# Altium schematic sheet PWR_LMR33630_5v_3A.SchDoc
size A3; SheetNumber: 22; SheetTotal: 22
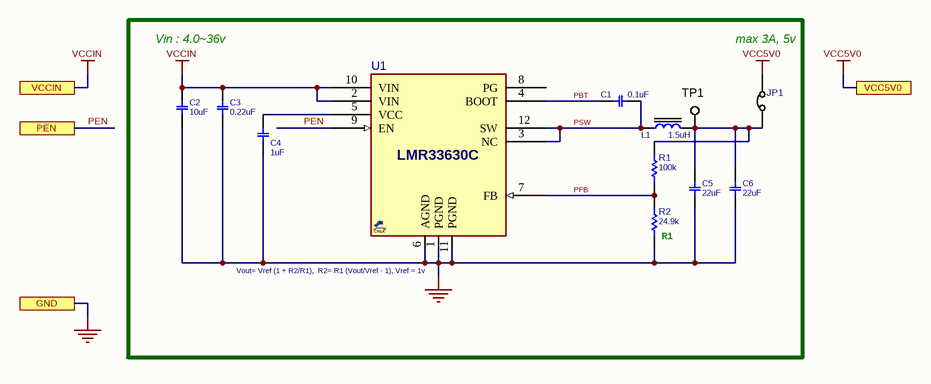
[diagram p0: PWR_LMR33630_5v_3A.SchDoc]

## Parts
C1  0.1uF  [C0402]
C2  10uF  [C0402]
C3  0.22uF  [C0402]
C4  1uF  [C0402]
C5  22uF  [C0402]
C6  22uF  [C0402]
JP1  R0Ohm  [JP_100X60]  (value not drawn)
L1  1.5uH  [L1210]
R1  100k  [R0402]
R2  24.9k  [R0402]
TP1  TESTPOINT_SMD  [TPSMD_S1]  (value not drawn)  (no BOM)
U1  LMR33630C  [QFNHR_12_RNX]  (value not drawn)

## Ports
GND, PEN, VCC5V0, VCCIN

## Nets
GND: C2.1 C3.2 C4.1 C5.1 C6.1 R2.2 U1.1(PGND) U1.6(AGND) U1.11(PGND) ; port GND
VCC5V0: JP1.2 ; port VCC5V0
VCCIN: C2.2 C3.1 U1.2(VIN) U1.10(VIN) ; port VCCIN
PBT: C1.1 U1.4(BOOT)
PEN: U1.9(EN) ; port PEN
PFB: R1.2 R2.1 U1.7(FB)
PSW: C1.2 L1.1 U1.3(NC) U1.12(SW)
NetC4_2: C4.2 U1.5(VCC)
NetC5_2: C5.2 C6.2 JP1.1 L1.2 R1.1 TP1.1

Not connected (* = marked no-connect by the designer): U1 8(PG)

## Notes on the sheet
- Vin : 4.0~36v
- (near JP1) max 3A, 5v
- (near R2) R1
- (near U1) Vout= Vref (1 + R2/R1),  R2= R1 (Vout/Vref - 1), Vref = 1v

## Library data of the parts
C1 = CAP_SMD_MLCC_100n50V: CAP, MLCC, 100nF, 50V, X7R, 10%, 0402C; PARAM: X5R, 10%; MANF: Murata; PARAM2: 25v; MANF_P#: GRM155R61E104; DESC: CAP, MLCC, 100nF, 50V, X7R, 10%, 0402C; ASSEMBLY: ASSEMBLY; PRICE: 10,000:$0.006; VALUE: 0.1uF; PACKAGE: 0402
C2 = CAP_SMD_MLCC: CAP, MLCC; PARAM: X5R, 20%; MANF_P#: CL05A106MP5NUNC; MANF: Samsung; PARAM2: 10v; PRICE: 10,000: $0.034; ASSEMBLY: ASSEMBLY; VALUE: 10uF; PACKAGE: 0402
C3 = CAP_SMD_MLCC_100n50V: CAP, MLCC, 0402C; PARAM: 50V; MANF: -; DESC: -; PARAM2: -; ASSEMBLY: ASSEMBLY; PRICE: 100= 1.3$; VALUE: 0.22uF; MANF_P#: -; PACKAGE: 0402
C4 = CAP_SMD_MLCC: CAP, MLCC; PARAM: X5R, 10%; MANF_P#: CL05A105KO5NNND; MANF: Samsung; PARAM2: 16v; PRICE: 50,000:	$0.006; ASSEMBLY: ASSEMBLY; VALUE: 1uF; PACKAGE: 0402
C5 C6 = CAP_SMD_MLCC: CAP, MLCC; PARAM: X5R, 10%; MANF_P#: GRM158R61A226ME15; MANF: Murata; PARAM2: 10v; PRICE: 8,000: $0.124; ASSEMBLY: ASSEMBLY; VALUE: 22uF; PACKAGE: 0603
JP1 = JUMPER_HDR_2P: JUMPER, HEADER 2PIN; MANF: -; MANF_P#: -; VALUE: R0Ohm
L1 = IND_SMD_2.2uH_4A: INDUCTOR; PARAM: 4.4A Irms, 5.0A Isat; MANF: Bourns; PARAM2: 22mOhm; MANF_P#: SRP3212A-1R5M; PRICE: 1.3$; DESC: -; ASSEMBLY: ASSEMBLY; VALUE: 1.5uH
R1 R2 = RES_SMD: RESISTOR, SMD, 20K, 0402; PARAM: 0.063W; DIST#: MOUSER; PARAM2: 1%; MANF: -; ASSEMBLY: ASSEMBLY; PRICE: 100= 0.5$; DESC: RESISTOR, SMD, 20K, 0402; MANF_P#: -; PACKAGE: 0402
  R1: VALUE: 100k
  R2: VALUE: 24.9k
TP1 = TESTPOINT_SMD: TEST POINT; MANF: MANF; MANF_P#: MANF_P#; VALUE: VALUE
U1 = VREG_LMR33630C_VQFNHR12: REG, Switching, Buck, 3A, ADJ, 2.1MHz, 3.8~36VIN, QFN12; MANF: Texas Instruments; MANF_P#: LMR33630CRNX; PARAM: 3A, 2.1MHz, -40~125oC; PARAM2: 3.8~36VIN, ADJ, 75mΩ; ASSEMBLY: ASSEMBLY; PRICE: 1$; VALUE: LMR33630C; PACKAGE: V-QFN-HR12